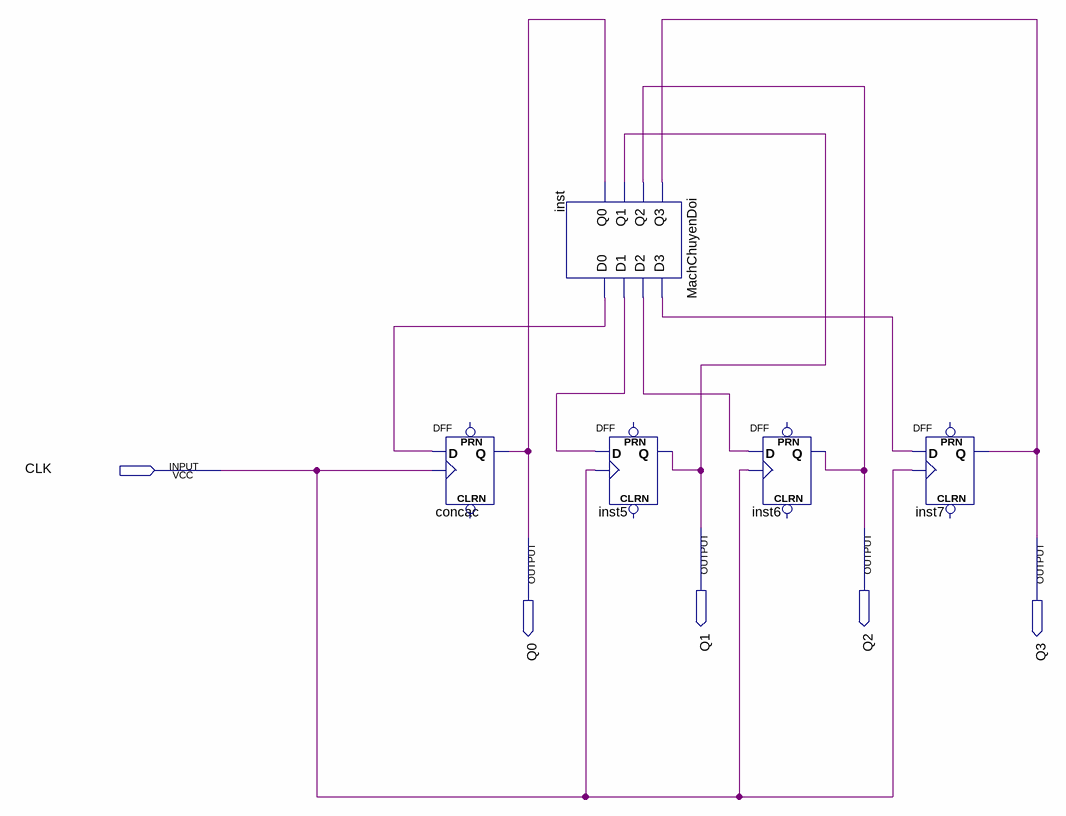
[diagram p0: schematic sheet]
// Quartus schematic Schematic2_ThietKeChinh.bdf as structural Verilog: 5 symbols, 5 pins
module Schematic2_ThietKeChinh (
  input  CLK,
  output Q1,
  output Q2,
  output Q0,
  output Q3
);

  wire inst_d0, inst_d1, inst_d2, inst_d3;

  DFF concac (.CLK(CLK), .D(inst_d0), .Q(Q0));  // open: CLRN, PRN
  MachChuyenDoi inst (.Q3(Q3), .Q2(Q2), .Q1(Q1), .Q0(Q0), .D3(inst_d3), .D2(inst_d2), .D1(inst_d1), .D0(inst_d0));
  DFF inst5 (.CLK(CLK), .D(inst_d1), .Q(Q1));  // open: CLRN, PRN
  DFF inst6 (.CLK(CLK), .D(inst_d2), .Q(Q2));  // open: CLRN, PRN
  DFF inst7 (.CLK(CLK), .D(inst_d3), .Q(Q3));  // open: CLRN, PRN
endmodule
